# EAGLE schematic oven_thermocouple_board (EAGLE 8.3.2)
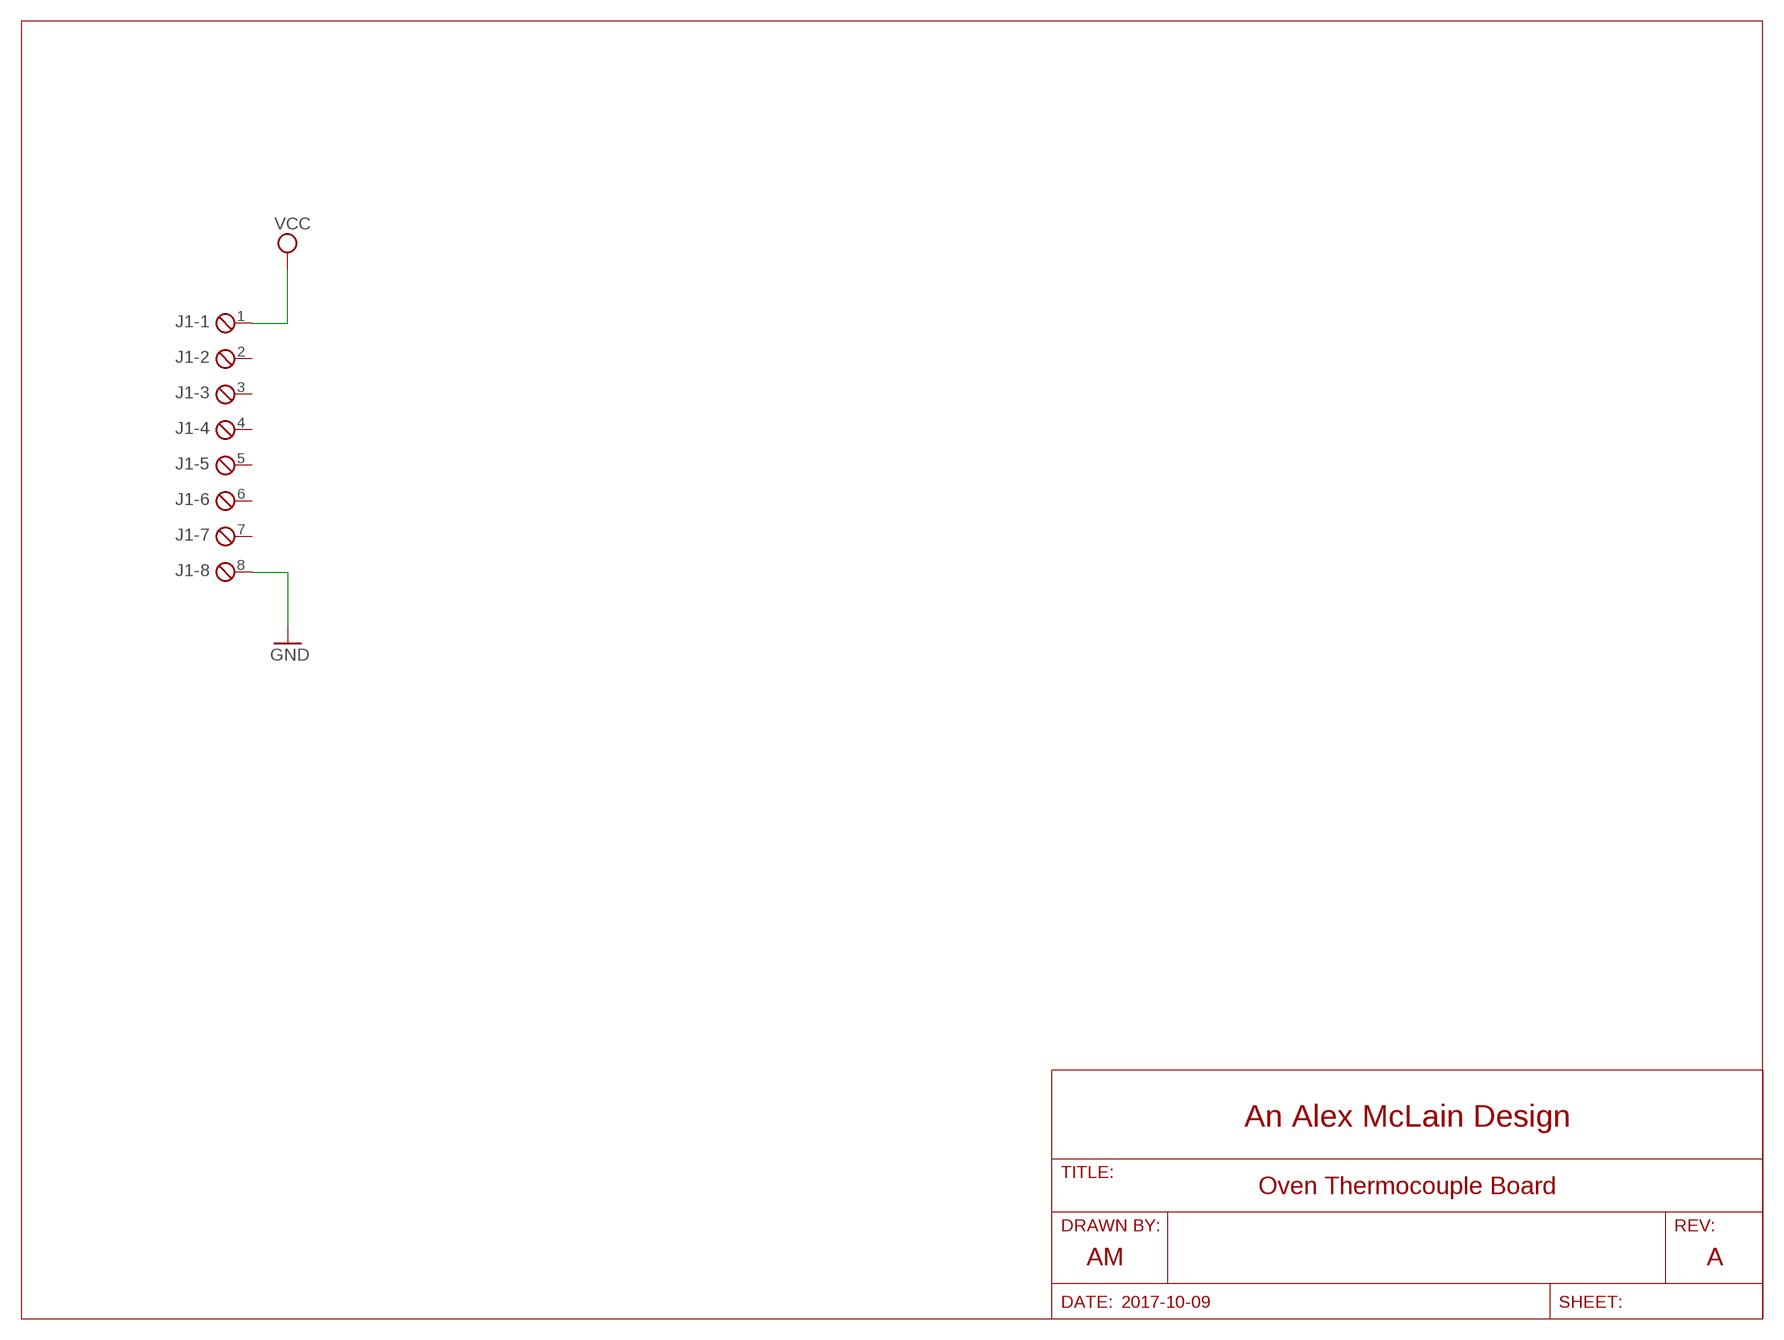
[diagram p0: schematic, sheet 1]
FRAME1 (LETTER_L): COMPANY_NAME: An Alex McLain Design; DATE_DRAWN: 2017-10-09; DRAWN_BY: AM; REV: A; TITLE: Oven Thermocouple Board

## Parts
J1  MPT8  [8POL254]

## Nets
GND: J1.8
VCC: J1.1
Unconnected: J1.2 J1.3 J1.4 J1.5 J1.6 J1.7

## Library data of the parts
J1 = con-phoenix-254:MPT8: PHOENIX CONNECTOR; OC_FARNELL: unknown; OC_NEWARK: unknown